# Altium schematic sheet AntDig.SchDoc: Устройство дистанционного управления с помощью телефона
size 420 x 297 mm; CheckedBy: Глазков В.В.; Author: Митр Д. В.; Address1: Address1; Address2: Address2; Address3: Address3; Address4: Address4; SheetNumber: 1; SheetTotal: 1; DocumentType: Схема электрическая принципиальная; DevelopedBy: Митр Д.В.; PageSetup: Record=PageOptions|CenterHorizontal=True|CenterVertical=True|PrintScale=0.94|XCorrection=1.00|YCorrection=1.00|PrintKind=1|BorderSize=5000000|LeftOffset=0|BottomOffset=0|Orientation=1|PaperLength=1000|PaperWidth=1000|Scale=100|PaperSource=7|PrintQuality=-4|MediaType=1|DitherType=10|PaperKind=A4|PrintScaleMode=1; DecimalNumber: Децимальный номер; HeadOfSector: Нач. сектора; MainDevice: Перв.примен.; Name: Наименование
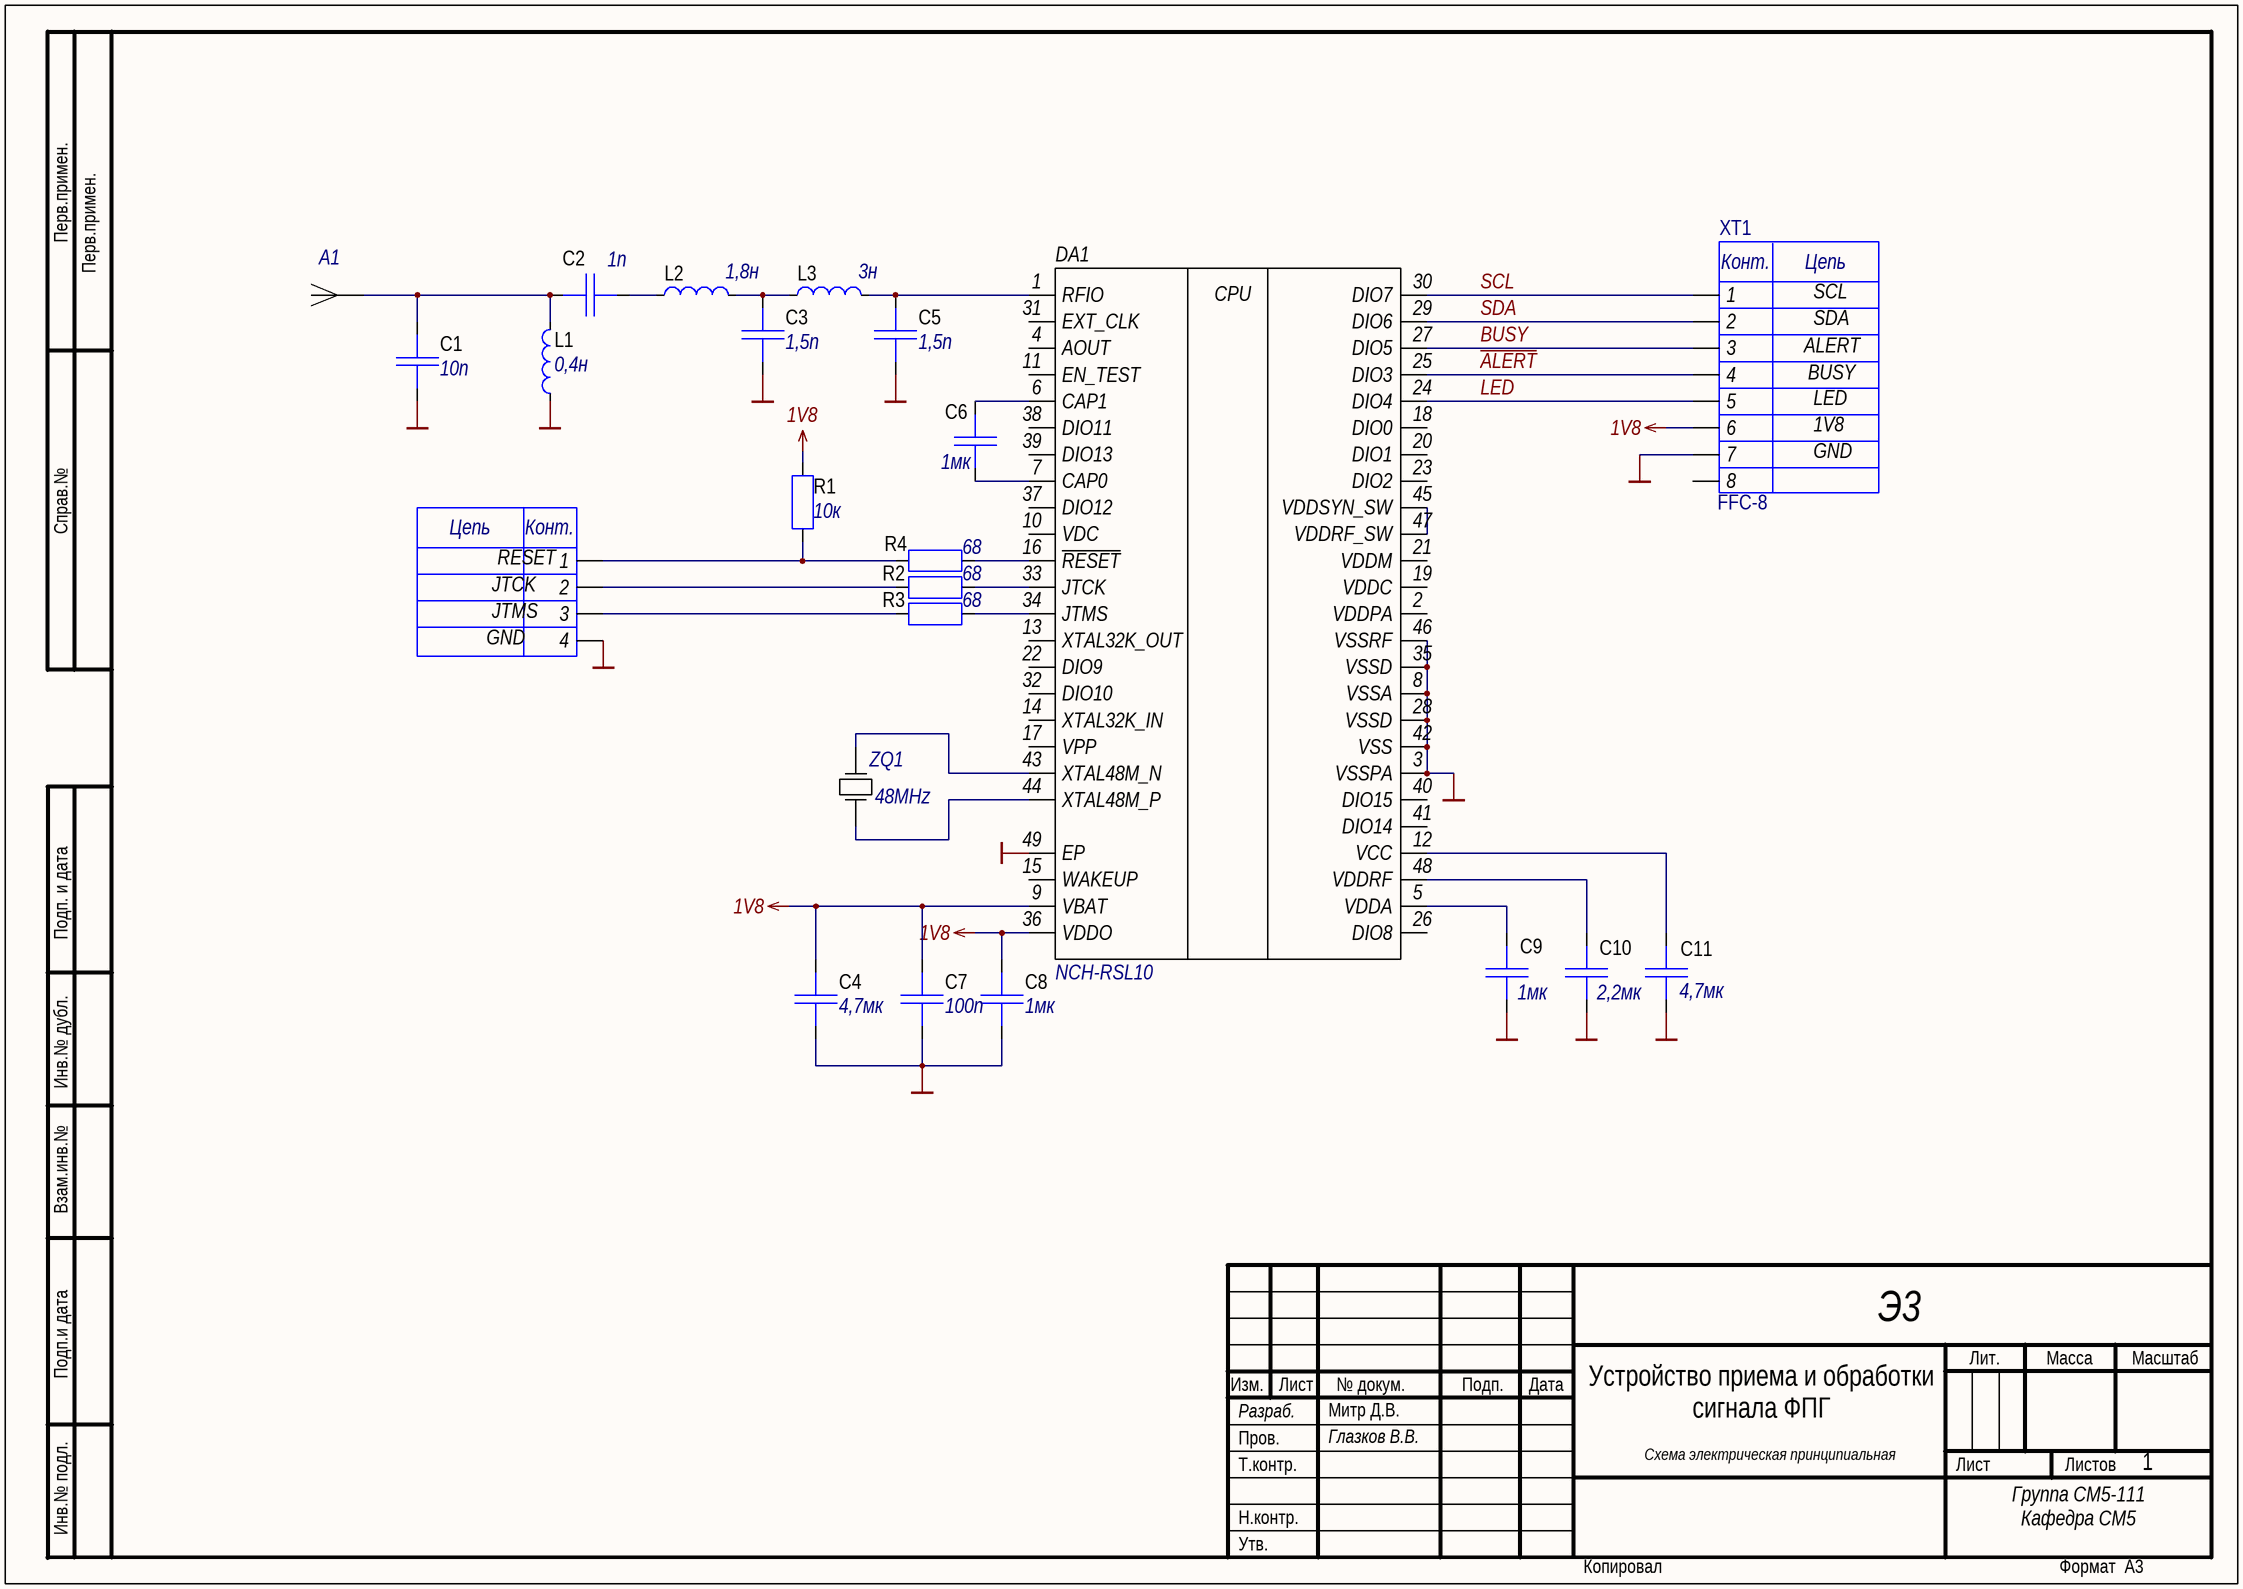
[diagram p0: AntDig.SchDoc]

## Parts
?  (no value)  [PSL_4]  (no BOM)
A1  Обозначение при заказе  [antenna]  (value not drawn)  (no BOM)
C1  10п  [cap0402]
C2  1п  [cap0402]
C3  1,5п  [cap0402]
C4  4,7мк  [cap0402]
C5  1,5п  [cap0402]
C6  1мк  [cap0402]
C7  100п  [cap0402]
C8  1мк  [cap0402]
C9  1мк  [cap0402]
C10  2,2мк  [cap0402]
C11  4,7мк  [cap0402]
DA1  Parameter 1: NCH-RSL10  [RSL10]  (hidden comment: RSL10)
L1  0,4н  [IND0402]
L2  1,8н  [IND0402]
L3  3н  [IND0402]
R1  10к  [RES0402]
R2  68  [RES0402]
R3  68  [RES0402]
R4  68  [RES0402]
XT1  name_main: FFC-8  [FFC8]
ZQ1  Parameter 1: 48MHz  [XTAL32]  (hidden comment: Обозначение при заказе)

## Nets
1V8: C4.2 C7.2 C8.2 DA1.9(VBAT) DA1.36(VDDO) R1.1 XT1.6
GND: ?.4 C1.1 C3.1 C4.1 C5.1 C7.1 C8.1 C9.1 C10.1 C11.1 DA1.3(VSSPA) DA1.8(VSSA) DA1.28(VSSD) DA1.35(VSSD) DA1.42(VSS) DA1.46(VSSRF) DA1.49(EP) L1.1 XT1.7
~{ALERT}: DA1.25(DIO3) XT1.4
BUSY: DA1.27(DIO5) XT1.3
LED: DA1.24(DIO4) XT1.5
SCL: DA1.30(DIO7) XT1.1
SDA: DA1.29(DIO6) XT1.2
Net?_1: ?.1 R1.2 R4.2
Net?_2: ?.2 R2.2
Net?_3: ?.3 R3.2
NetA1_1: A1.1 C1.2 C2.2 L1.2
NetC2_1: C2.1 L2.1
NetC3_2: C3.2 L2.2 L3.1
NetC5_2: C5.2 DA1.1(RFIO) L3.2
NetC6_1: C6.1 DA1.7(CAP0)
NetC6_2: C6.2 DA1.6(CAP1)
NetC9_2: C9.2 DA1.5(VDDA)
NetC10_2: C10.2 DA1.48(VDDRF)
NetC11_2: C11.2 DA1.12(VCC)
NetDA1_16: DA1.16(~{RESET}) R4.1
NetDA1_33: DA1.33(JTCK) R2.1
NetDA1_34: DA1.34(JTMS) R3.1
NetDA1_43: DA1.43(XTAL48M_N) ZQ1.2
NetDA1_44: DA1.44(XTAL48M_P) ZQ1.1
NetDA1_45: DA1.45(VDDSYN_SW) DA1.47(VDDRF_SW)

Not connected (* = marked no-connect by the designer): DA1 2(VDDPA) 4(AOUT) 10(VDC) 11(EN_TEST) 13(XTAL32K_OUT) 14(XTAL32K_IN) 15(WAKEUP) 17(VPP) 18(DIO0) 19(VDDC) 20(DIO1) 21(VDDM) 22(DIO9) 23(DIO2) 26(DIO8) 31(EXT_CLK) 32(DIO10) 37(DIO12) 38(DIO11) 39(DIO13) 40(DIO15) 41(DIO14); XT1 8

## Notes on the sheet
- SCL
- SDA
- ALERT
- BUSY
- LED
- 1V8
- GND
- Э3
- Устройство приема и обработки сигнала ФПГ
- 1
- Перв.примен.
- Справ.№
- Подп. и дата
- Инв.№ дубл.
- Взам.инв.№
- Подп.и дата
- Разраб.
- Изм.
- Лист
- № докум.
- Подп.
- Дата
- Лит.
- Масса
- Масштаб
- Т.контр.
- Пров.
- Митр Д.В.
- Глазков В.В.
- Схема электрическая принципиальная
- Листов
- Инв.№ подл.
- Утв.
- Н.контр.
- Группа СМ5-111
  Кафедра СМ5
  МГТУ им Н.Э.Баумана
- Копировал
- Формат  A3
- (in symbol FFC8) Конт.; Цепь
- (in symbol PSL4) Цепь; Конт.; RESET; JTCK; JTMS; GND
- (in symbol RSL10) CPU

## Library data of the parts
? = PSL4: manufacture: БСАР.430420.014ТУ; name: Разъемы; name_main: PLS-6
A1 = antenna: Описание свойств компонента
C1 = CapCer: Керамический конденсатор; manufacture: ОЖО.460.107ТУ; name_main: GRM1535C1H100J; Units: Ф; Name: Керамический конденсатор; Value: 10п
C2 = CapCer: Керамический конденсатор; manufacture: ОЖО.460.107ТУ; name_main: GRM1555C1H1R0BA01D; Units: Ф; Name: Керамический конденсатор; Value: 1п
C3 C5 = CapCer: Керамический конденсатор; manufacture: ОЖО.460.107ТУ; name_main: CL10C1R5CB8NNNC; Units: Ф; Name: Керамический конденсатор; Value: 1,5п
C4 C11 = CapCer: Керамический конденсатор; manufacture: ОЖО.460.107ТУ; name_main: GRM21BR60J335K; Units: Ф; Name: Керамический конденсатор; Value: 4,7мк
C6 C8 C9 = CapCer: Керамический конденсатор; manufacture: ОЖО.460.107ТУ; nameSuf: -3; name_main: CC0603KRX7R7BB105; Units: Ф; Name: Керамический конденсатор; Value: 1мк
C7 = CapCer: Керамический конденсатор; manufacture: ОЖО.460.107ТУ; name_main: GRM1885C1H101J; Units: Ф; Name: Керамический конденсатор; Value: 100п
C10 = CapCer: Керамический конденсатор; manufacture: ОЖО.460.107ТУ; name_main: GRM188R61A225K; Units: Ф; Name: Керамический конденсатор; Value: 2,2мк
L1 = Ind: Катушка индуктивности; Units: Гн; name_main: MLG1005S0N4BTD25; Name: Катушка индуктивности; Value: 0,4н
L2 = Ind: Катушка индуктивности; Units: Гн; name_main: LQG15HN1N8S02D; Name: Катушка индуктивности; Value: 1,8н
L3 = Ind: Катушка индуктивности; Units: Гн; name_main: LQG15HS3N0S02D; Name: Катушка индуктивности; Value: 3н
R1 = Res: Резистор; Manufacturer: АЛЯР.434110.005ТУ; Tolerance: 5%; name_main: RC0603FR-0710KL; Name: Резистор; Value: 10к
R2-R4 = Res: Резистор; Manufacturer: АЛЯР.434110.005ТУ; name_main: AC0603FR-0768RL; Name: Резистор; Value: 68
XT1 = FFC8: manufacture: 2328702-8; name: Разъемы
ZQ1 = XTAL32.768: FC-135 32.7680KA-AG0